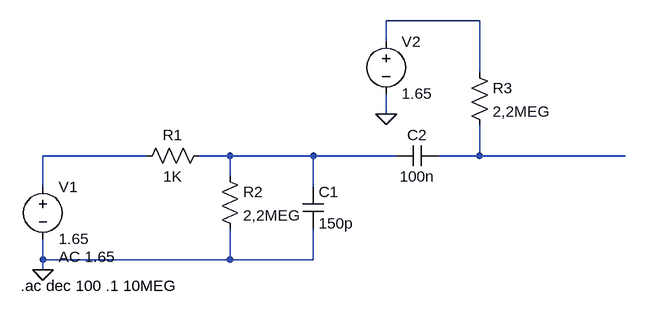
[diagram p0: schematic Draft4.asc]
Draft4.asc, the LTspice schematic file:
Version 4
SHEET 1 880 680
WIRE 624 -64 480 -64
WIRE 480 -32 480 -64
WIRE 624 16 624 -64
WIRE 480 80 480 48
WIRE 112 144 -48 144
WIRE 240 144 192 144
WIRE 368 144 240 144
WIRE 496 144 368 144
WIRE 624 144 624 96
WIRE 624 144 560 144
WIRE 848 144 624 144
WIRE 240 176 240 144
WIRE -48 192 -48 144
WIRE 368 192 368 144
WIRE -48 304 -48 272
WIRE 240 304 240 256
WIRE 240 304 -48 304
WIRE 368 304 368 256
WIRE 368 304 240 304
WIRE -48 320 -48 304
FLAG -48 320 0
FLAG 480 80 0
SYMBOL res 96 160 R270
WINDOW 0 32 56 VTop 2
WINDOW 3 0 56 VBottom 2
SYMATTR InstName R1
SYMATTR Value 1K
SYMBOL res 224 160 R0
SYMATTR InstName R2
SYMATTR Value 2,2MEG
SYMBOL cap 352 192 R0
SYMATTR InstName C1
SYMATTR Value 150p
SYMBOL voltage -48 176 R0
WINDOW 123 24 124 Left 2
WINDOW 39 0 0 Left 0
SYMATTR InstName V1
SYMATTR Value 1.65
SYMATTR Value2 AC 1.65
SYMBOL cap 560 128 R90
WINDOW 0 0 32 VBottom 2
WINDOW 3 32 32 VTop 2
SYMATTR InstName C2
SYMATTR Value 100n
SYMBOL res 608 0 R0
SYMATTR InstName R3
SYMATTR Value 2,2MEG
SYMBOL voltage 480 -48 R0
SYMATTR InstName V2
SYMATTR Value 1.65
TEXT -82 344 Left 2 !.ac dec 100 .1 10MEG

The netlist it stands for:
* Draft4.asc
R1 N002 N003 1K
R2 N003 0 2,2MEG
C1 N003 0 150p
V1 N002 0 1.65 AC 1.65
C2 N004 N003 100n
R3 N001 N004 2,2MEG
V2 N001 0 1.65
.ac dec 100 .1 10MEG
.backanno
.end